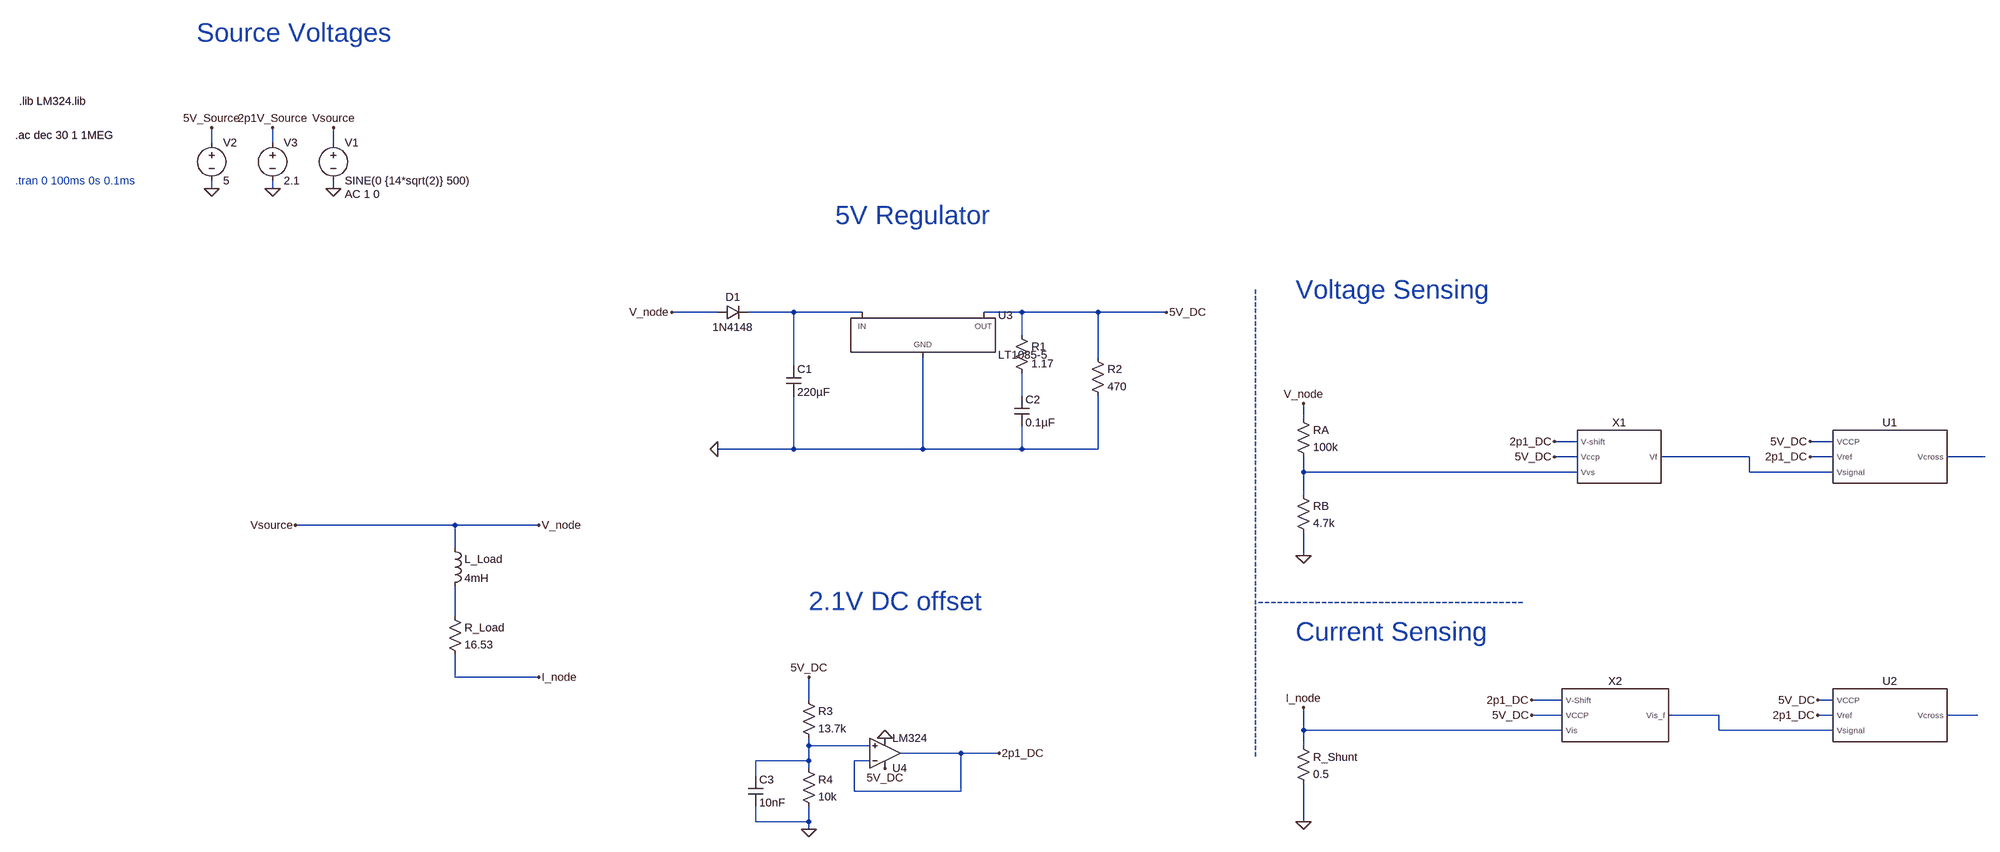
[diagram p0: schematic FinalParentSchematic.asc]
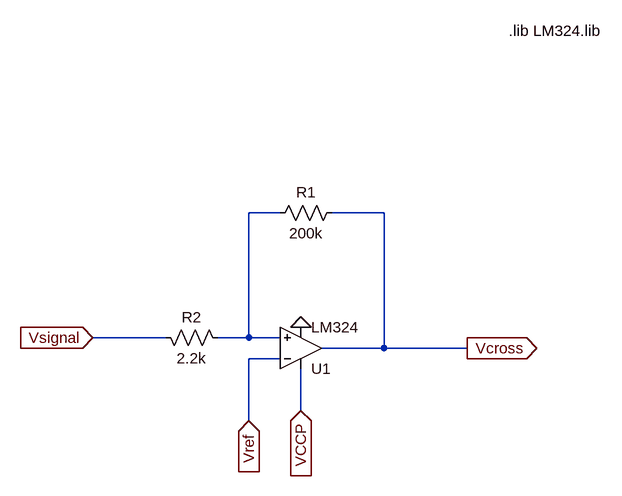
[diagram p1: sub-circuit zerocrossing.asc]
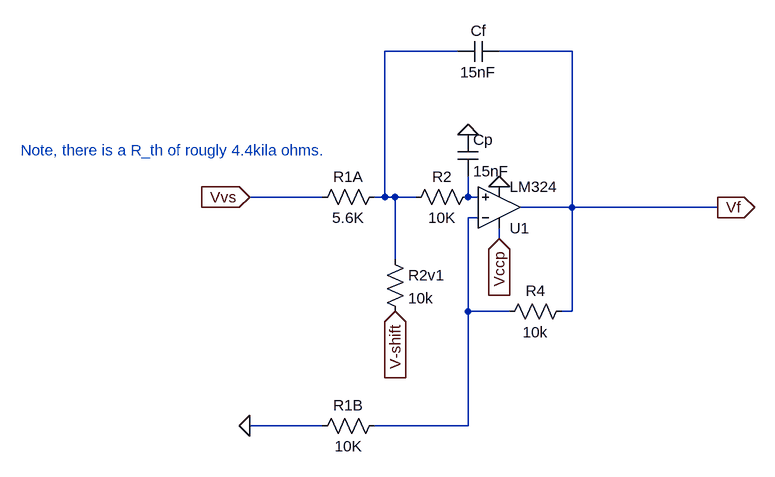
[diagram p2: sub-circuit sig_cond-2ord.asc]
FinalParentSchematic.asc, the LTspice schematic file:
Version 4.1
SHEET 1 3620 1340
WIRE -704 -240 -704 -272
WIRE -576 -240 -576 -272
WIRE -448 -240 -448 -272
WIRE -704 -144 -704 -160
WIRE -576 -144 -576 -160
WIRE -448 -144 -448 -160
WIRE 480 160 384 160
WIRE 640 160 544 160
WIRE 784 160 640 160
WIRE 1120 160 1040 160
WIRE 1280 160 1120 160
WIRE 1424 160 1280 160
WIRE 1120 208 1120 160
WIRE 1280 256 1280 160
WIRE 640 272 640 160
WIRE 1120 336 1120 288
WIRE 1984 384 1984 352
WIRE 2560 432 2512 432
WIRE 3296 432 3248 432
WIRE 640 448 640 336
WIRE 640 448 480 448
WIRE 912 448 912 256
WIRE 912 448 640 448
WIRE 1120 448 1120 400
WIRE 1120 448 912 448
WIRE 1280 448 1280 336
WIRE 1280 448 1120 448
WIRE 2560 464 2512 464
WIRE 3120 464 2736 464
WIRE 3296 464 3248 464
WIRE 3616 464 3536 464
WIRE 1984 496 1984 464
WIRE 2560 496 1984 496
WIRE 3120 496 3120 464
WIRE 3296 496 3120 496
WIRE 1984 544 1984 496
WIRE -192 608 -528 608
WIRE -16 608 -192 608
WIRE -192 656 -192 608
WIRE 1984 672 1984 624
WIRE -192 800 -192 736
WIRE -192 928 -192 880
WIRE -16 928 -192 928
WIRE 672 976 672 928
WIRE 2528 976 2464 976
WIRE 3296 976 3264 976
WIRE 2528 1008 2464 1008
WIRE 3056 1008 2752 1008
WIRE 3296 1008 3264 1008
WIRE 3600 1008 3536 1008
WIRE 1984 1040 1984 992
WIRE 2528 1040 1984 1040
WIRE 3056 1040 3056 1008
WIRE 3296 1040 3056 1040
WIRE 672 1072 672 1056
WIRE 800 1072 672 1072
WIRE 1984 1072 1984 1040
WIRE 992 1088 864 1088
WIRE 1072 1088 992 1088
WIRE 672 1104 672 1072
WIRE 672 1104 560 1104
WIRE 800 1104 768 1104
WIRE 672 1120 672 1104
WIRE 560 1136 560 1104
WIRE 768 1168 768 1104
WIRE 992 1168 992 1088
WIRE 992 1168 768 1168
WIRE 560 1232 560 1200
WIRE 672 1232 672 1200
WIRE 672 1232 560 1232
WIRE 1984 1232 1984 1152
WIRE 672 1248 672 1232
FLAG -448 -144 0
FLAG -448 -272 Vsource
FLAG -528 608 Vsource
FLAG -16 608 V_node
FLAG -16 928 I_node
FLAG 1984 352 V_node
FLAG 1984 1232 0
FLAG 1984 992 I_node
FLAG 480 448 0
FLAG 384 160 V_node
FLAG 1424 160 5V_DC
FLAG 2512 464 5V_DC
FLAG 672 928 5V_DC
FLAG 672 1248 0
FLAG 2512 432 2p1_DC
FLAG 3264 1008 2p1_DC
FLAG 3248 464 2p1_DC
FLAG 3248 432 5V_DC
FLAG 3264 976 5V_DC
FLAG 1072 1088 2p1_DC
FLAG 832 1056 0
FLAG 832 1120 5V_DC
FLAG 1984 672 0
FLAG 2464 1008 5V_DC
FLAG 2464 976 2p1_DC
FLAG -704 -144 0
FLAG -576 -144 0
FLAG -704 -272 5V_Source
FLAG -576 -272 2p1V_Source
SYMBOL voltage -448 -256 R0
WINDOW 123 24 124 Left 2
WINDOW 39 0 0 Left 0
SYMATTR Value2 AC 1 0
SYMATTR InstName V1
SYMATTR Value SINE(0 {14*sqrt(2)} 500)
SYMBOL ind -208 640 R0
SYMATTR InstName L_Load
SYMATTR Value 4mH
SYMATTR SpiceLine Rser=1m
SYMBOL res -208 784 R0
SYMATTR InstName R_Load
SYMATTR Value 16.53
SYMBOL res 1968 368 R0
SYMATTR InstName RA
SYMATTR Value 100k
SYMBOL res 1968 528 R0
SYMATTR InstName RB
SYMATTR Value 4.7k
SYMBOL res 1968 1056 R0
SYMATTR InstName R_Shunt
SYMATTR Value 0.5
SYMBOL ZeroCrossing 3408 464 R0
SYMATTR InstName U1
SYMBOL ZeroCrossing 3408 1008 R0
SYMATTR InstName U2
SYMBOL PowerProducts\\LT1085-5 912 160 R0
SYMATTR InstName U3
SYMBOL cap 1104 336 R0
SYMATTR InstName C2
SYMATTR Value 0.1µF
SYMBOL diode 480 176 R270
WINDOW 0 32 32 VTop 2
WINDOW 3 0 32 VBottom 2
SYMATTR InstName D1
SYMATTR Value 1N4148
SYMBOL res 1264 240 R0
SYMATTR InstName R2
SYMATTR Value 470
SYMBOL OpAmps\\opamp2 832 1152 M180
SYMATTR InstName U4
SYMATTR Value LM324
SYMBOL res 656 960 R0
SYMATTR InstName R3
SYMATTR Value 13.7k
SYMBOL res 656 1104 R0
SYMATTR InstName R4
SYMATTR Value 10k
SYMBOL cap 544 1136 R0
SYMATTR InstName C3
SYMATTR Value 10nF
SYMBOL voltage -704 -256 R0
WINDOW 123 0 0 Left 0
WINDOW 39 0 0 Left 0
SYMATTR InstName V2
SYMATTR Value 5
SYMBOL voltage -576 -256 R0
WINDOW 123 0 0 Left 0
WINDOW 39 0 0 Left 0
SYMATTR InstName V3
SYMATTR Value 2.1
SYMBOL cap 624 272 R0
SYMATTR InstName C1
SYMATTR Value 220µF
SYMBOL res 1104 192 R0
SYMATTR InstName R1
SYMATTR Value 1.17
SYMBOL sig_cond-2ord 2640 464 R0
SYMATTR InstName X1
SYMBOL sig_cond_2ord_shunt 2640 1008 R0
SYMATTR InstName X2
TEXT 1888 768 Left 4 ;------------------------------------------
TEXT 1880 80 VRight 4 ;--------------------------------------------------------------------------
TEXT 1968 112 Left 5 ;Voltage Sensing
TEXT 1968 832 Left 5 ;Current Sensing
TEXT -1304 -160 Left 2 ;.tran 0 100ms 0s 0.1ms
TEXT -1296 -328 Left 2 !.lib LM324.lib
TEXT -1304 -256 Left 2 !.ac dec 30 1 1MEG
TEXT -736 -504 Left 5 ;Source Voltages
TEXT 728 -88 Left 5 ;5V Regulator
TEXT 672 768 Left 5 ;2.1V DC offset

zerocrossing.asc, the sub-circuit schematic file:
Version 4.1
SHEET 1 880 680
WIRE 48 -64 0 -64
WIRE 208 -64 128 -64
WIRE -128 128 -240 128
WIRE 0 128 0 -64
WIRE 0 128 -48 128
WIRE 48 128 0 128
WIRE 208 144 208 -64
WIRE 208 144 112 144
WIRE 336 144 208 144
WIRE 48 160 0 160
WIRE 80 240 80 176
WIRE 0 256 0 160
FLAG 0 256 Vref
IOPIN 0 256 In
FLAG -240 128 Vsignal
IOPIN -240 128 In
FLAG 80 112 0
FLAG 80 240 VCCP
IOPIN 80 240 In
FLAG 336 144 Vcross
IOPIN 336 144 Out
SYMBOL OpAmps\\opamp2 80 208 M180
SYMATTR InstName U1
SYMATTR Value LM324
SYMBOL res -144 112 M90
WINDOW 0 0 56 VBottom 2
WINDOW 3 32 56 VTop 2
SYMATTR InstName R2
SYMATTR Value 2.2k
SYMBOL res 144 -80 R90
WINDOW 0 0 56 VBottom 2
WINDOW 3 32 56 VTop 2
SYMATTR InstName R1
SYMATTR Value 200k
TEXT 400 -344 Left 2 !.lib LM324.lib

sig_cond-2ord.asc, the sub-circuit schematic file:
Version 4.1
SHEET 1 880 680
WIRE -864 -3824 -976 -3824
WIRE -688 -3824 -800 -3824
WIRE -1072 -3600 -1184 -3600
WIRE -976 -3600 -976 -3824
WIRE -976 -3600 -992 -3600
WIRE -960 -3600 -976 -3600
WIRE -928 -3600 -960 -3600
WIRE -848 -3600 -848 -3632
WIRE -832 -3600 -848 -3600
WIRE -688 -3584 -688 -3824
WIRE -688 -3584 -768 -3584
WIRE -464 -3584 -688 -3584
WIRE -832 -3568 -848 -3568
WIRE -800 -3536 -800 -3552
WIRE -960 -3504 -960 -3600
WIRE -848 -3424 -848 -3568
WIRE -784 -3424 -848 -3424
WIRE -688 -3424 -688 -3584
WIRE -688 -3424 -704 -3424
WIRE -1072 -3248 -1184 -3248
WIRE -848 -3248 -848 -3424
WIRE -848 -3248 -992 -3248
FLAG -464 -3584 Vf
IOPIN -464 -3584 Out
FLAG -1184 -3600 Vvs
IOPIN -1184 -3600 In
FLAG -960 -3424 V-shift
IOPIN -960 -3424 In
FLAG -800 -3536 Vccp
IOPIN -800 -3536 In
FLAG -800 -3616 0
FLAG -1184 -3248 0
FLAG -848 -3696 0
SYMBOL OpAmps\\opamp2 -800 -3520 M180
SYMATTR InstName U1
SYMATTR Value LM324
SYMBOL res -976 -3616 R90
WINDOW 0 0 56 VBottom 2
WINDOW 3 32 56 VTop 2
SYMATTR InstName R1A
SYMATTR Value 5.6K
SYMBOL res -688 -3440 R90
WINDOW 0 0 56 VBottom 2
WINDOW 3 32 56 VTop 2
SYMATTR InstName R4
SYMATTR Value 10k
SYMBOL res -976 -3264 R90
WINDOW 0 0 56 VBottom 2
WINDOW 3 32 56 VTop 2
<<<<<<< HEAD
SYMATTR InstName R2g
=======
SYMATTR InstName R1B
>>>>>>> b50d384b78e713e7427b0f54554ea35b88b9f067
SYMATTR Value 10K
SYMBOL res -976 -3520 R0
SYMATTR InstName R2v1
SYMATTR Value 10k
SYMBOL cap -864 -3696 R0
SYMATTR InstName Cp
SYMATTR Value 15nF
SYMBOL cap -800 -3840 R90
WINDOW 0 0 32 VBottom 2
WINDOW 3 32 32 VTop 2
SYMATTR InstName Cf
SYMATTR Value 15nF
SYMBOL res -832 -3616 R90
WINDOW 0 0 56 VBottom 2
WINDOW 3 32 56 VTop 2
SYMATTR InstName R2
SYMATTR Value 10K
TEXT -1536 -3672 Left 2 ;Note, there is a R_th of rougly 4.4kila ohms.

The netlist it stands for:
* FinalParentSchematic.asc
V1 V_node 0 SINE(0 {14*sqrt(2)} 500) AC 1 0
L_Load V_node N006 4mH Rser=1m
R_Load N006 I_node 16.53
RA V_node N005 100k
RB N005 0 4.7k
R_Shunt I_node 0 0.5
X§U1 5V_DC 2p1_DC N003 N004 zerocrossing
X§U2 5V_DC 2p1_DC N007 N008 zerocrossing
X§U3 0 5V_DC N001 LT1085-5  ; pins GND OUT IN
C2 N002 0 0.1µF
D1 V_node N001 1N4148
R2 5V_DC 0 470
X§U4 N009 2p1_DC 5V_DC 0 2p1_DC LM324  ; pins In+ In- V+ V- OUT
R3 5V_DC N009 13.7k
R4 N009 0 10k
C3 N009 0 10nF
V2 5V_Source 0 5
V3 2p1V_Source 0 2.1
C1 N001 0 220µF
R1 5V_DC N002 1.17
X§X1 2p1_DC 5V_DC N005 N003 sig_cond-2ord
X§X2 2p1_DC 5V_DC I_node N007 sig_cond_2ord_shunt  ; pins V-Shift VCCP Vis Vis_f

* block symbol definitions
.subckt zerocrossing VCCP Vref Vsignal Vcross
X§U1 N001 Vref VCCP 0 Vcross LM324  ; pins In+ In- V+ V- OUT
R2 Vsignal N001 2.2k
R1 Vcross N001 200k
.lib LM324.lib
.ends zerocrossing

.subckt sig_cond-2ord V-shift Vccp Vvs Vf
X§U1 N002 N003 Vccp 0 Vf LM324  ; pins In+ In- V+ V- OUT
R1A N001 Vvs 5.6K
R4 Vf N003 10k
R1B N003 0 10K
R2v1 N001 V-shift 10k
Cp 0 N002 15nF
Cf Vf N001 15nF
R2 N002 N001 10K
* Note, there is a R_th of rougly 4.4kila ohms.
.ends sig_cond-2ord

.model D D
.lib standard.dio
* ------------------------------------------
* --------------------------------------------------------------------------
* Voltage Sensing
* Current Sensing
* .tran 0 100ms 0s 0.1ms
.lib LM324.lib
.ac dec 30 1 1MEG
* Source Voltages
* 5V Regulator
* 2.1V DC offset
.backanno
.end